# Altium schematic sheet Tead_Aliens_64A_Power.SchDoc: Tead Aliens 64A Power
size A4; Date: 27/01/2021; CheckedBy: NeperMath; Author: NeperMath; DrawnBy: NeperMath; Engineer: NeperMath; DocumentNumber: 1; Revision: 1; SheetNumber: 1; SheetTotal: 1; CurrentTime: 23:12; CurrentDate: 27/01/2021; Time: 23:12
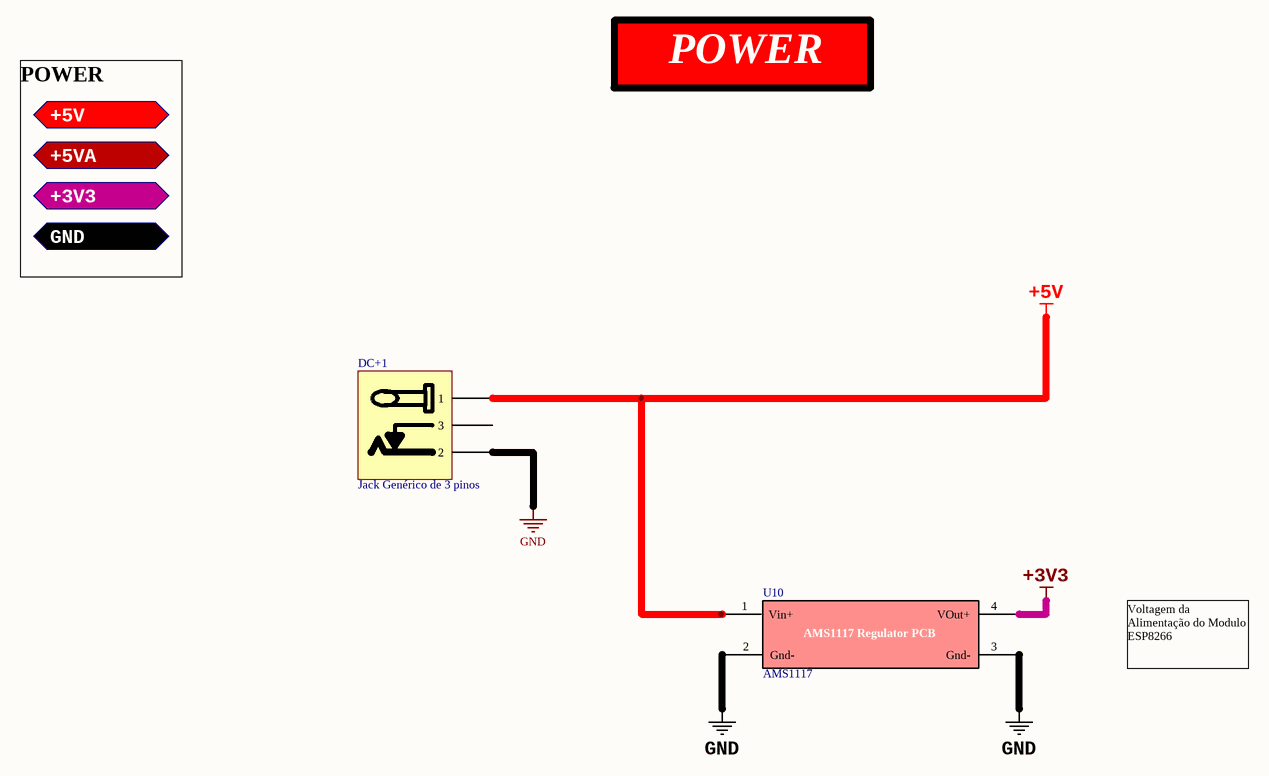
[diagram p0: Tead_Aliens_64A_Power.SchDoc]

## Parts
DC+1  Jack Genérico de 3 pinos  [Jack P4]
U10  AMS1117  [ANS1117_Reg_Pcb]

## Ports
+3V3, +5V, +5VA, GND

## Nets
+3V3: U10.4(VOut+)
+5V: DC+1.1 U10.1(Vin+)
GND: DC+1.2 U10.2(Gnd-) U10.3(Gnd-)

Not connected (* = marked no-connect by the designer): DC+1 3

## Notes on the sheet
- POWER
- Voltagem da Alimentação do Modulo ESP8266
- Title
- Size:
- Date:
- A4
- Number:
- Time:
- Revision:
- Sheet
- of
- File:
- (in symbol AMS1117) AMS1117 Regulator PCB

## Library data of the parts
U10 = AMS1117: AMS1117 REGULATOR PCB